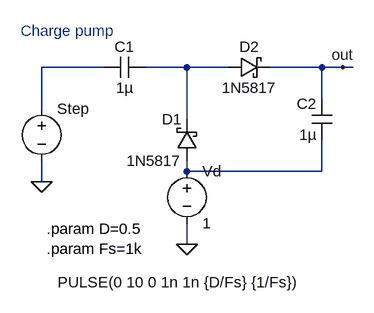
[diagram p0: schematic charge pump_dickson_2902.asc]
charge pump_dickson_2902.asc, the LTspice schematic file:
Version 4
SHEET 1 880 680
WIRE 96 112 0 112
WIRE 224 112 160 112
WIRE 288 112 224 112
WIRE 432 112 352 112
WIRE 464 112 432 112
WIRE 480 112 464 112
WIRE 432 160 432 112
WIRE 0 176 0 112
WIRE 224 192 224 112
WIRE 224 272 224 256
WIRE 432 272 432 224
WIRE 432 272 224 272
WIRE 0 288 0 256
WIRE 224 384 224 352
FLAG 0 288 0
FLAG 224 384 0
FLAG 464 112 out
SYMBOL voltage 0 160 R0
WINDOW 3 25 283 Left 2
WINDOW 123 0 0 Left 0
WINDOW 39 0 0 Left 0
SYMATTR Value PULSE(0 10 0 1n 1n {D/Fs} {1/Fs})
SYMATTR InstName Step
SYMBOL cap 160 96 R90
WINDOW 0 0 32 VBottom 2
WINDOW 3 32 32 VTop 2
SYMATTR InstName C1
SYMATTR Value 1µ
SYMBOL schottky 240 256 R180
WINDOW 0 24 64 Left 2
WINDOW 3 24 0 Left 2
SYMATTR InstName D1
SYMATTR Value 1N5817
SYMATTR Description Diode
SYMATTR Type diode
SYMBOL schottky 288 128 R270
WINDOW 0 32 32 VTop 2
WINDOW 3 0 32 VBottom 2
SYMATTR InstName D2
SYMATTR Value 1N5817
SYMATTR Description Diode
SYMATTR Type diode
SYMBOL voltage 224 256 R0
WINDOW 123 0 0 Left 0
WINDOW 39 0 0 Left 0
SYMATTR InstName Vd
SYMATTR Value 1
SYMBOL cap 448 224 R180
WINDOW 0 24 56 Left 2
WINDOW 3 24 8 Left 2
SYMATTR InstName C2
SYMATTR Value 1µ
TEXT -32 56 Left 2 ;Charge pump
TEXT 8 360 Left 2 !.param D=0.5\n.param Fs=1k

The netlist it stands for:
* charge pump_dickson_2902.asc
V§Step N001 0 PULSE(0 10 0 1n 1n {D/Fs} {1/Fs})
C1 N002 N001 1µ
D1 N003 N002 1N5817
D2 N002 out 1N5817
Vd N003 0 1
C2 N003 out 1µ
.model D D
.lib standard.dio
* Charge pump
.param D=0.5
.param Fs=1k
.backanno
.end